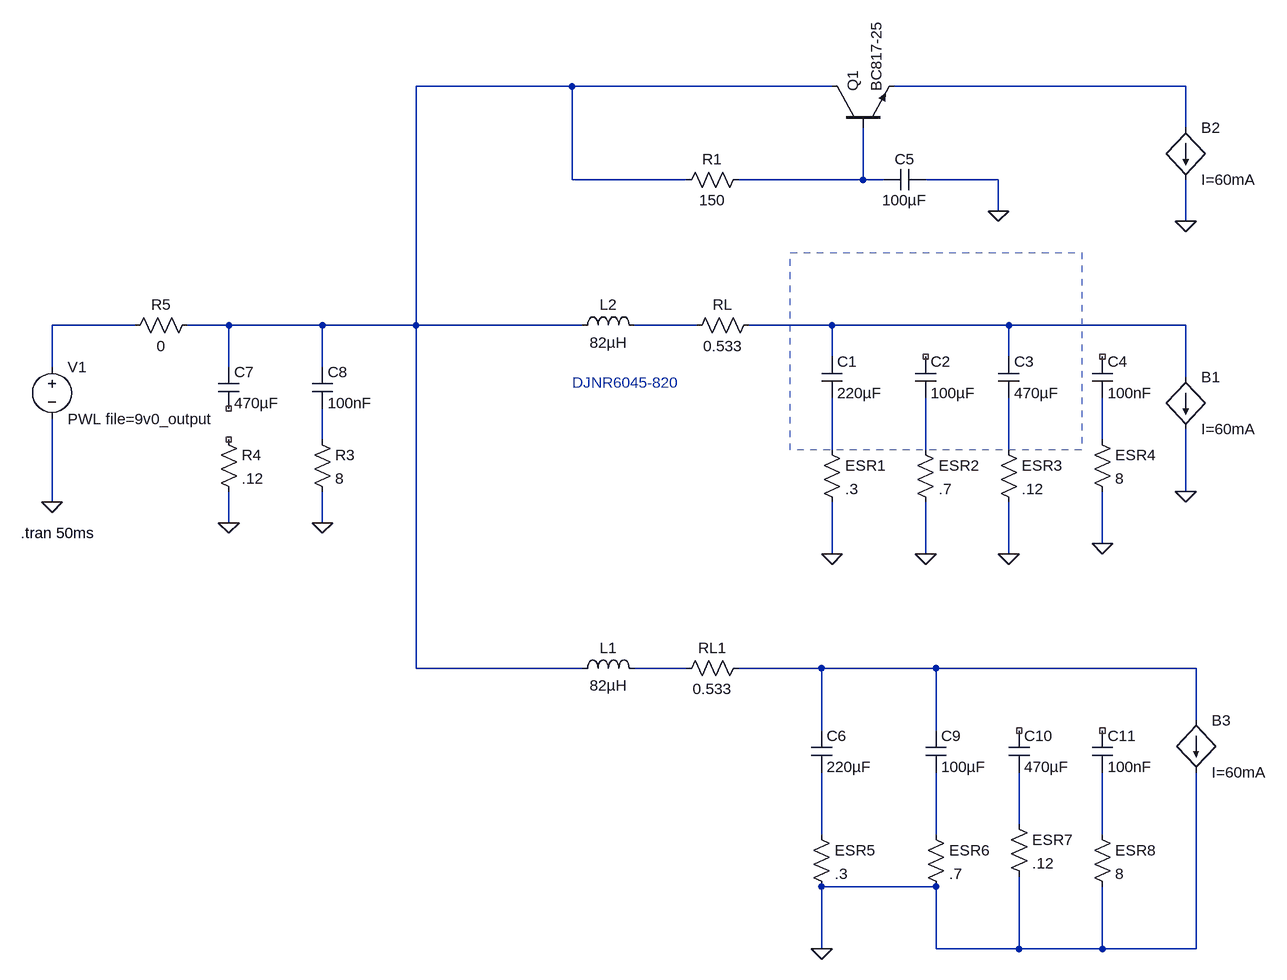
[diagram p0: schematic 9V0.asc]
9V0.asc, the LTspice schematic file:
Version 4
SHEET 1 1668 1060
WIRE 336 -288 96 -288
WIRE 736 -288 336 -288
WIRE 1280 -288 832 -288
WIRE 1280 -224 1280 -288
WIRE 336 -144 336 -288
WIRE 512 -144 336 -144
WIRE 784 -144 784 -224
WIRE 784 -144 592 -144
WIRE 816 -144 784 -144
WIRE 992 -144 880 -144
WIRE 992 -96 992 -144
WIRE 1280 -80 1280 -144
WIRE -336 80 -464 80
WIRE -192 80 -256 80
WIRE -48 80 -192 80
WIRE 96 80 96 -288
WIRE 96 80 -48 80
WIRE 352 80 96 80
WIRE 528 80 432 80
WIRE 736 80 608 80
WIRE 1008 80 736 80
WIRE 1280 80 1008 80
WIRE 736 128 736 80
WIRE 1008 128 1008 80
WIRE -464 144 -464 80
WIRE -192 144 -192 80
WIRE -48 144 -48 80
WIRE 1280 160 1280 80
WIRE -48 256 -48 208
WIRE 1152 256 1152 192
WIRE 736 272 736 192
WIRE 880 272 880 192
WIRE 1008 272 1008 192
WIRE 1280 336 1280 240
WIRE -464 352 -464 224
WIRE -192 384 -192 336
WIRE -48 384 -48 336
WIRE 1152 416 1152 336
WIRE 736 432 736 352
WIRE 880 432 880 352
WIRE 1008 432 1008 352
WIRE 96 608 96 80
WIRE 352 608 96 608
WIRE 512 608 432 608
WIRE 720 608 592 608
WIRE 896 608 720 608
WIRE 1296 608 896 608
WIRE 1296 688 1296 608
WIRE 720 704 720 608
WIRE 896 704 896 608
WIRE 1024 848 1024 768
WIRE 720 864 720 768
WIRE 896 864 896 768
WIRE 1152 864 1152 768
WIRE 896 944 720 944
WIRE 720 1040 720 944
WIRE 896 1040 896 944
WIRE 1024 1040 1024 928
WIRE 1024 1040 896 1040
WIRE 1152 1040 1152 944
WIRE 1152 1040 1024 1040
WIRE 1296 1040 1296 768
WIRE 1296 1040 1152 1040
FLAG -464 352 0
FLAG 1280 336 0
FLAG 736 432 0
FLAG 880 432 0
FLAG 1008 432 0
FLAG 1152 416 0
FLAG 1280 -80 0
FLAG 992 -96 0
FLAG -192 384 0
FLAG -48 384 0
FLAG 720 1040 0
SYMBOL voltage -464 128 R0
WINDOW 123 0 0 Left 0
WINDOW 39 0 0 Left 0
SYMATTR InstName V1
SYMATTR Value PWL file=9v0_output
SYMBOL res 624 64 R90
WINDOW 0 0 56 VBottom 2
WINDOW 3 32 56 VTop 2
SYMATTR InstName RL
SYMATTR Value 0.533
SYMBOL bi 1280 160 R0
SYMATTR InstName B1
SYMATTR Value I=60mA
SYMBOL cap 720 128 R0
SYMATTR InstName C1
SYMATTR Value 220µF
SYMBOL cap 864 128 R0
SYMATTR InstName C2
SYMATTR Value 100µF
SYMBOL cap 992 128 R0
SYMATTR InstName C3
SYMATTR Value 470µF
SYMBOL res 720 256 R0
SYMATTR InstName ESR1
SYMATTR Value .3
SYMBOL res 864 256 R0
SYMATTR InstName ESR2
SYMATTR Value .7
SYMBOL res 992 256 R0
SYMATTR InstName ESR3
SYMATTR Value .12
SYMBOL ind 336 96 R270
WINDOW 0 32 56 VTop 2
WINDOW 3 5 56 VBottom 2
SYMATTR InstName L2
SYMATTR Value 82µH
SYMATTR SpiceLine Rser=0
SYMBOL cap 1136 128 R0
SYMATTR InstName C4
SYMATTR Value 100nF
SYMBOL res 1136 240 R0
SYMATTR InstName ESR4
SYMATTR Value 8
SYMBOL npn 736 -224 R270
SYMATTR InstName Q1
SYMATTR Value BC817-25
SYMBOL res 608 -160 R90
WINDOW 0 0 56 VBottom 2
WINDOW 3 32 56 VTop 2
SYMATTR InstName R1
SYMATTR Value 150
SYMBOL cap 880 -160 R90
WINDOW 0 0 32 VBottom 2
WINDOW 3 32 32 VTop 2
SYMATTR InstName C5
SYMATTR Value 100µF
SYMBOL bi 1280 -224 R0
SYMATTR InstName B2
SYMATTR Value I=60mA
SYMBOL cap -208 144 R0
SYMATTR InstName C7
SYMATTR Value 470µF
SYMBOL cap -64 144 R0
SYMATTR InstName C8
SYMATTR Value 100nF
SYMBOL res -64 240 R0
SYMATTR InstName R3
SYMATTR Value 8
SYMBOL res -208 240 R0
SYMATTR InstName R4
SYMATTR Value .12
SYMBOL res -240 64 R90
WINDOW 0 0 56 VBottom 2
WINDOW 3 32 56 VTop 2
SYMATTR InstName R5
SYMATTR Value 0
SYMBOL ind 336 624 R270
WINDOW 0 32 56 VTop 2
WINDOW 3 5 56 VBottom 2
SYMATTR InstName L1
SYMATTR Value 82µH
SYMATTR SpiceLine Rser=0
SYMBOL res 608 592 R90
WINDOW 0 0 56 VBottom 2
WINDOW 3 32 56 VTop 2
SYMATTR InstName RL1
SYMATTR Value 0.533
SYMBOL cap 704 704 R0
SYMATTR InstName C6
SYMATTR Value 220µF
SYMBOL res 704 848 R0
SYMATTR InstName ESR5
SYMATTR Value .3
SYMBOL cap 880 704 R0
SYMATTR InstName C9
SYMATTR Value 100µF
SYMBOL res 880 848 R0
SYMATTR InstName ESR6
SYMATTR Value .7
SYMBOL cap 1008 704 R0
SYMATTR InstName C10
SYMATTR Value 470µF
SYMBOL res 1008 832 R0
SYMATTR InstName ESR7
SYMATTR Value .12
SYMBOL cap 1136 704 R0
SYMATTR InstName C11
SYMATTR Value 100nF
SYMBOL res 1136 848 R0
SYMATTR InstName ESR8
SYMATTR Value 8
SYMBOL bi 1296 688 R0
SYMATTR InstName B3
SYMATTR Value I=60mA
TEXT -512 400 Left 2 !.tran 50ms
TEXT 336 168 Left 2 ;DJNR6045-820
RECTANGLE Normal 1120 272 672 -32 2

The netlist it stands for:
* 9V0.asc
V1 N004 0 PWL file=9v0_output
RL N006 N005 0.533
B1 N006 0 I=60mA
C1 N006 N009 220µF
C2 NC_01 N010 100µF
C3 N006 N011 470µF
R§ESR1 N009 0 .3
R§ESR2 N010 0 .7
R§ESR3 N011 0 .12
L2 N001 N005 82µH Rser=0
C4 NC_02 N008 100nF
R§ESR4 N008 0 8
Q1 N001 N003 N002 0 BC817-25
R1 N003 N001 150
C5 0 N003 100µF
B2 N002 0 I=60mA
C7 N001 NC_03 470µF
C8 N001 N007 100nF
R3 N007 0 8
R4 NC_04 0 .12
R5 N001 N004 0
L1 N001 N012 82µH Rser=0
RL1 N013 N012 0.533
C6 N013 N015 220µF
R§ESR5 N015 0 .3
C9 N013 N016 100µF
R§ESR6 N016 0 .7
C10 NC_05 N014 470µF
R§ESR7 N014 0 .12
C11 NC_06 N017 100nF
R§ESR8 N017 0 8
B3 N013 0 I=60mA
.model NPN NPN
.model PNP PNP
.lib standard.bjt
.tran 50ms
* DJNR6045-820
.backanno
.end